# EAGLE design Untitled (EAGLE 6.6.0)
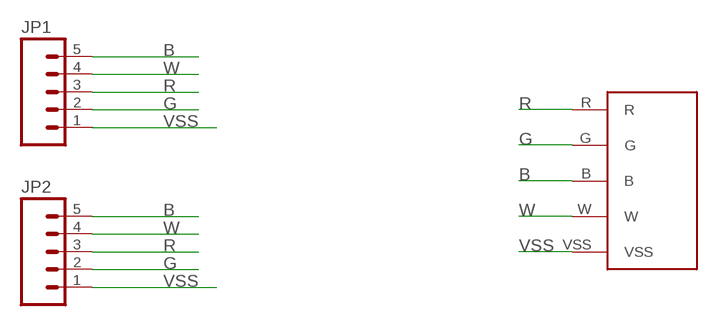
[diagram p0: schematic, sheet 1]

## Parts
JP1  M05PTH_LONGPADS  [1X05_LONGPADS]
JP2  M05PTH_LONGPADS  [1X05_LONGPADS]
U$1  RGBWSTRIP  [RGBWSTRIP]

## Nets
B: JP1.5 JP2.5 U$1.B
G: JP1.2 JP2.2 U$1.G
R: JP1.3 JP2.3 U$1.R
VSS: JP1.1 JP2.1 U$1.VSS
W: JP1.4 JP2.4 U$1.W

## Library data of the parts
JP1 JP2 = SparkFun-Connectors:M05: Header 5 Standard 5-pin 0.1" header. Use with straight break away headers (SKU : PRT-00116), right angle break away headers (PRT-00553), swiss pins (PRT-00743), machine pins (PRT-00117), and female headers (PRT-00115). Molex polarized connector foot print use with SKU : PRT-08230 with associated crimp pins and housings.
U$1 = SmoothTechnology:RGBWSTRIP

## Board
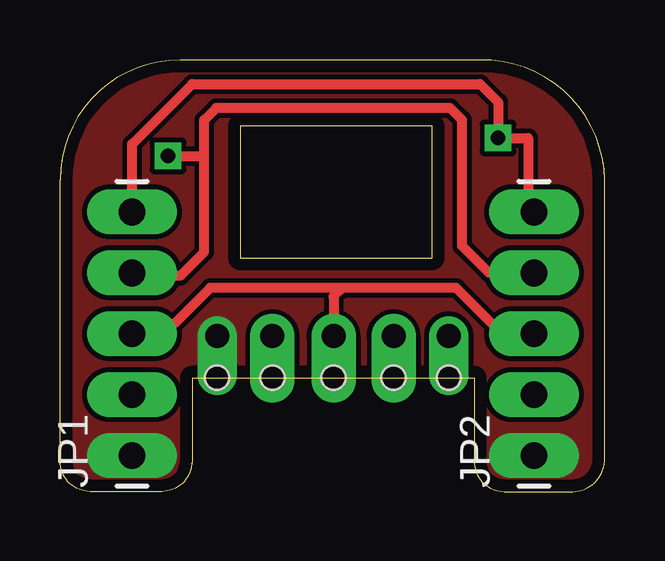
[diagram p1: board, top side]
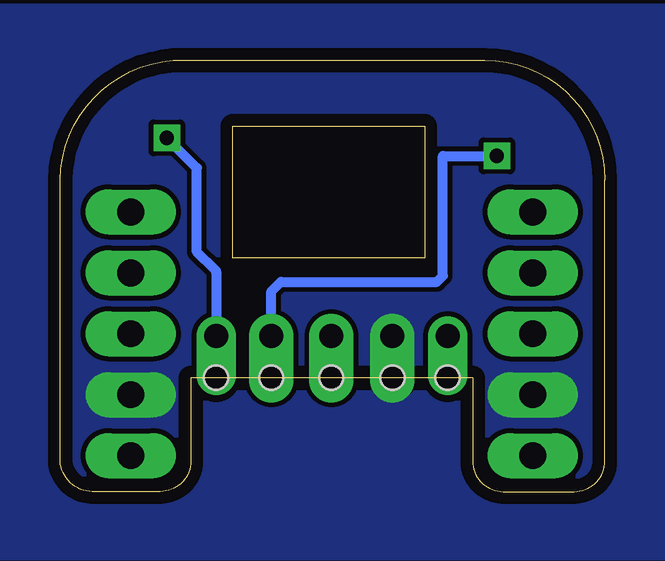
[diagram p2: board, bottom side, seen from below]

Size 22.7 x 18 mm. Coordinates in mm from the lower left corner, seen from the top.
Outline: 5.5,4.75 17.25,4.75 17.25,1.27 arc90 18.52,0 21.23,0 arc90 22.7,1.27 22.7,13 arc90 17.5,18 5,18 arc90 0,13 0,1.27 arc90 1.27,0 4.23,0 arc90 5.5,1.27 5.5,4.75
Outline: 7.5,15.25 7.5,9.75 15.5,9.75 15.5,15.25 7.5,15.25
Copper layers (1*16): Top 0.035mm / dielectric 1.5mm / Bottom 0.035mm
Design rules "PCBCart-Standard": minimum track width 8mil, minimum drill 0.4mm, track to track 8mil, track to pad 8mil, pad to pad 8mil, via to via 8mil, smd to smd 8mil, copper to edge 20mil, drill to drill 8mil, minimum pad ring 8mil, minimum via ring 10mil, stop-mask expansion 3mil, vias tented up to drill 20mil, thermal gap 8mil

### Footprints (pad centres in the part's own frame; a part is rotated, then mirrored left to right if it is on the bottom)
1X05_LONGPADS = drill 1.118 pad 1.88 long: 1 0,0; 2 2.54,0; 3 5.08,0; 4 7.62,0; 5 10.16,0
RGBWSTRIP = drill 1 pad 1.65 offset: B 4.798,-0.011; VSS -4.852,-0.011 | drill 1 pad 1.85 offset: G -2.552,-0.011; R -0.002,-0.011; W 2.498,-0.011 | hole 1: -4.852,-1.75; -2.552,-1.75; -0.002,-1.75; 2.498,-1.75; 4.798,-1.75

### Placement (x,y rotation side)
JP1  3,1.5 90 top
JP2  19.75,1.5 90 top
U$1  11.4,6.5 0 top

### Tracks (layer width: path | path; a pad name or v marks a point on that pad's centre or on a via)
B  (via drill 0.6)
  Top 0.406: JP2.5 19.5,11.66 19.5,14.75 v18.25,14.75 18.25,16.25 17.5,17 5.5,17 3,14.5 JP1.5
  Bottom 0.406: v18.25,14.75 17,13.5 17,10 16.23,9.23 arc45 16.2,9.16 U$1.B
G
  pour Bottom (no thermals): -4.75,20.25 -4.5,-2.75 25.5,-2.75 25.25,20.25
R
  Top 0.406: JP2.3 18.67,6.33 16.5,8.5 11.75,8.5 | 11.75,8.5 6.25,8.5 4.75,7 3.42,7 JP1.3 | 11.75,8.5 11.43,8.18 arc45 11.4,8.11 U$1.R
VSS
  pour Top (no thermals): -1.5,19.75 -1.5,-1.25 23.5,-1.25 23.5,19.75
W  (via drill 0.6)
  Top 0.406: JP1.4 3.12,9 5,9 6,10 6,14 | 6,14 6,15.5 6.5,16 16.25,16 16.75,15.5 16.75,10.25 17.88,9.12 JP2.4 | v4.5,14 6,14
  Bottom 0.406: U$1.W 13.9,8.36 13.5,8.75 7,8.75 6.75,9 6.75,14 v4.5,14